# Altium schematic sheet PATHOS_DriveBoard.SchDoc: Drive Board for PATHOS
size A4; Author: A. Kalberer; CompanyName: NTB; DrawnBy: A. Kalberer; Organization: NTB Interstate University of Applied; Address1: Werdenbergstrasse 4; Address3: 9471 Buchs; Address4: Switzerland; DocumentNumber: 1; Revision: 0.1; SheetNumber: 1; SheetTotal: 5; Organization1: Sciences of Technology Buchs; Size: A4; ShortDescription: Main Sheet for Drive Board
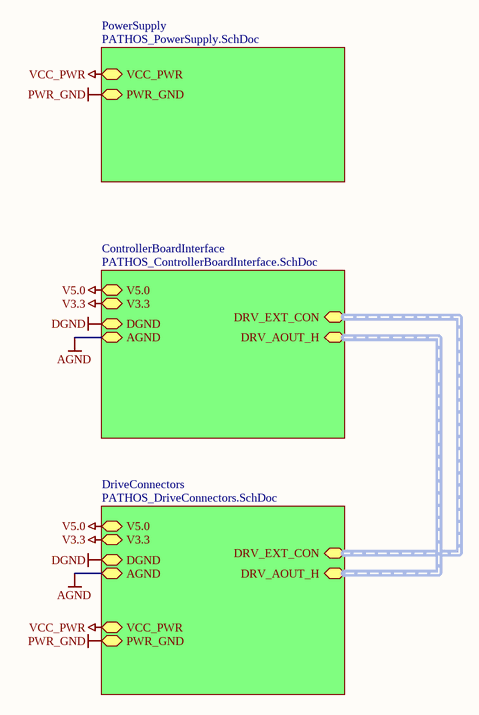
[diagram p0: PATHOS_DriveBoard.SchDoc]

## Sub-sheets
ControllerBoardInterface = PATHOS_ControllerBoardInterface.SchDoc: V5.0, V3.3, DGND, AGND, DRV_EXT_CON (harness DRV_EXT_CON), DRV_AOUT_H (harness DRV_AOUT_H)
DriveConnectors = PATHOS_DriveConnectors.SchDoc: V5.0, V3.3, DGND, AGND, VCC_PWR, PWR_GND, DRV_EXT_CON (harness DRV_EXT_CON), DRV_AOUT_H (harness DRV_AOUT_H)
PowerSupply = PATHOS_PowerSupply.SchDoc: VCC_PWR, PWR_GND

## Nets
AGND: sheet ControllerBoardInterface/AGND, sheet DriveConnectors/AGND
DGND: sheet ControllerBoardInterface/DGND, sheet DriveConnectors/DGND
PWR_GND: sheet PowerSupply/PWR_GND, sheet DriveConnectors/PWR_GND
V3.3: sheet ControllerBoardInterface/V3.3, sheet DriveConnectors/V3.3
V5.0: sheet ControllerBoardInterface/V5.0, sheet DriveConnectors/V5.0
VCC_PWR: sheet PowerSupply/VCC_PWR, sheet DriveConnectors/VCC_PWR

## Buses and harness runs
harness sheet ControllerBoardInterface/DRV_AOUT_H = sheet DriveConnectors/DRV_AOUT_H
harness sheet ControllerBoardInterface/DRV_EXT_CON = sheet DriveConnectors/DRV_EXT_CON

## Notes on the sheet
- Title:
- Description:
- Size:
- Date:
- Name:
- Number:
- Time:
- Revision:
- Sheet
- Checked:
- of
- File: